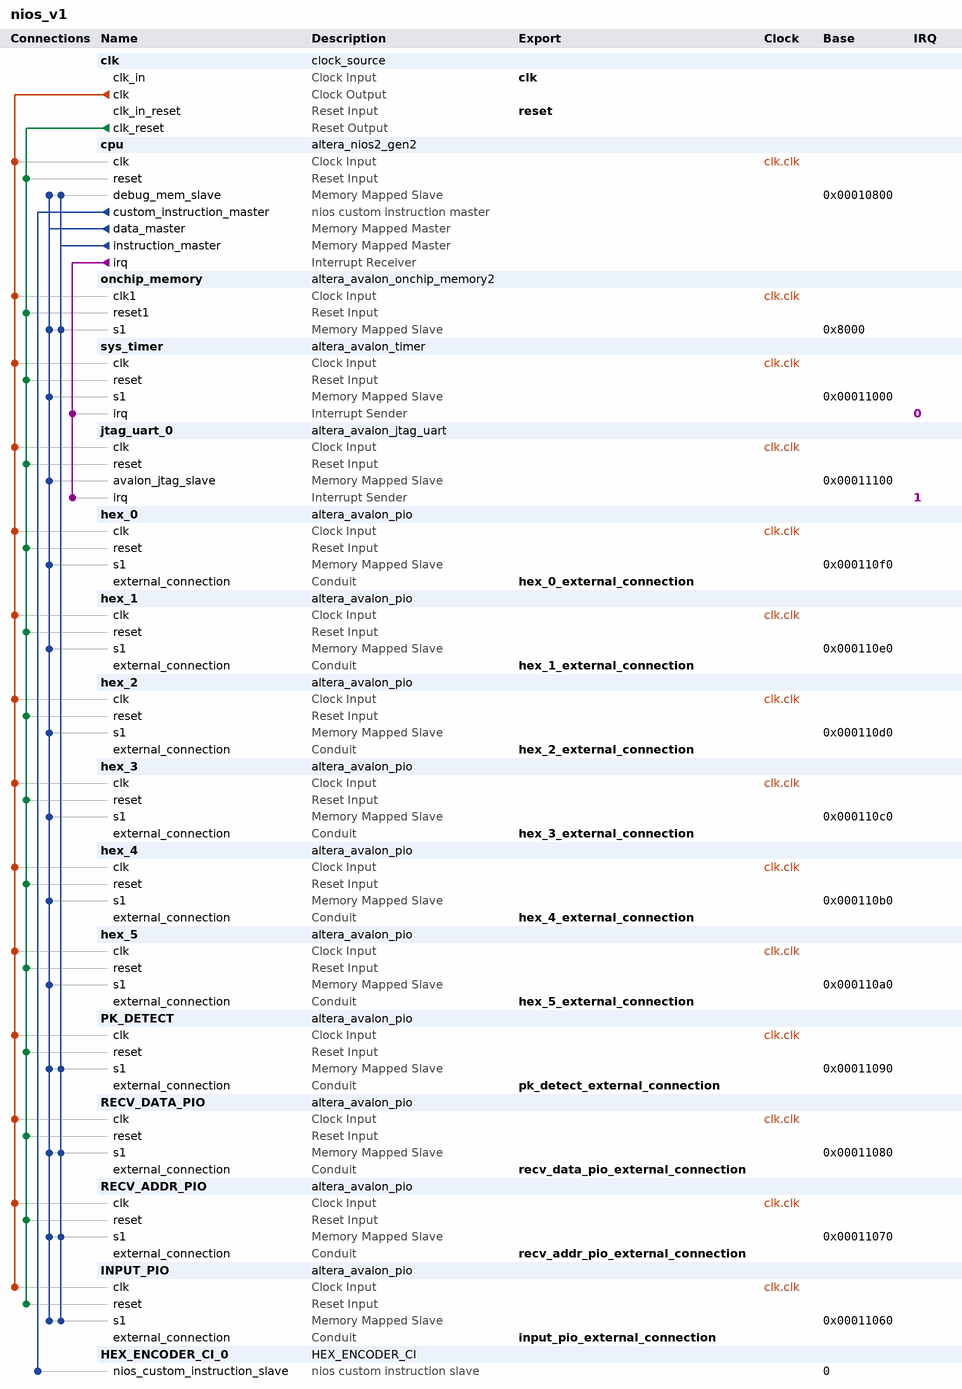
[diagram p0: system contents]
# Platform Designer (Qsys) system nios_v1, Cyclone V 5CSEMA5F31C6
# Parameters at their usual value, and those the tool derives, are not listed.
package require -exact qsys 18.1
create_system nios_v1
set_project_property DEVICE_FAMILY {Cyclone V}
set_project_property DEVICE 5CSEMA5F31C6

add_instance clk clock_source 18.1
set_instance_parameter_value clk clockFrequency 50000000

add_instance cpu altera_nios2_gen2 18.1
set_instance_parameter_value cpu cpuID 1
set_instance_parameter_value cpu dcache_size 2048
set_instance_parameter_value cpu exceptionSlave onchip_memory.s1
set_instance_parameter_value cpu icache_size 4096
set_instance_parameter_value cpu impl Fast
set_instance_parameter_value cpu resetSlave onchip_memory.s1

add_instance onchip_memory altera_avalon_onchip_memory2 18.1
set_instance_parameter_value onchip_memory dataWidth 32
set_instance_parameter_value onchip_memory dualPort false
set_instance_parameter_value onchip_memory initMemContent true
set_instance_parameter_value onchip_memory initializationFileName onchip_mem.hex
set_instance_parameter_value onchip_memory memorySize 20480

add_instance sys_timer altera_avalon_timer 18.1
set_instance_parameter_value sys_timer period 1
set_instance_parameter_value sys_timer periodUnits MSEC

add_instance jtag_uart_0 altera_avalon_jtag_uart 18.1
set_instance_parameter_value jtag_uart_0 simInteractiveOptions NO_INTERACTIVE_WINDOWS

add_instance hex_0 altera_avalon_pio 18.1
set_instance_parameter_value hex_0 direction Output
set_instance_parameter_value hex_0 width 7

add_instance hex_1 altera_avalon_pio 18.1
set_instance_parameter_value hex_1 direction Output
set_instance_parameter_value hex_1 width 7

add_instance hex_2 altera_avalon_pio 18.1
set_instance_parameter_value hex_2 direction Output
set_instance_parameter_value hex_2 width 7

add_instance hex_3 altera_avalon_pio 18.1
set_instance_parameter_value hex_3 direction Output
set_instance_parameter_value hex_3 width 7

add_instance hex_4 altera_avalon_pio 18.1
set_instance_parameter_value hex_4 direction Output
set_instance_parameter_value hex_4 width 7

add_instance hex_5 altera_avalon_pio 18.1
set_instance_parameter_value hex_5 direction Output
set_instance_parameter_value hex_5 width 7

add_instance PK_DETECT altera_avalon_pio 18.1
set_instance_parameter_value PK_DETECT direction Input
set_instance_parameter_value PK_DETECT width 1

add_instance RECV_DATA_PIO altera_avalon_pio 18.1
set_instance_parameter_value RECV_DATA_PIO direction Input
set_instance_parameter_value RECV_DATA_PIO width 32

add_instance RECV_ADDR_PIO altera_avalon_pio 18.1
set_instance_parameter_value RECV_ADDR_PIO direction Input
set_instance_parameter_value RECV_ADDR_PIO width 8

add_instance INPUT_PIO altera_avalon_pio 18.1
set_instance_parameter_value INPUT_PIO direction Input
set_instance_parameter_value INPUT_PIO width 32

add_instance HEX_ENCODER_CI_0 HEX_ENCODER_CI 1.0

# connections
add_connection clk.clk cpu.clk clock
add_connection clk.clk hex_0.clk clock
add_connection clk.clk hex_1.clk clock
add_connection clk.clk hex_2.clk clock
add_connection clk.clk hex_3.clk clock
add_connection clk.clk hex_4.clk clock
add_connection clk.clk hex_5.clk clock
add_connection clk.clk INPUT_PIO.clk clock
add_connection clk.clk jtag_uart_0.clk clock
add_connection clk.clk onchip_memory.clk1 clock
add_connection clk.clk PK_DETECT.clk clock
add_connection clk.clk RECV_ADDR_PIO.clk clock
add_connection clk.clk RECV_DATA_PIO.clk clock
add_connection clk.clk sys_timer.clk clock
add_connection clk.clk_reset cpu.reset reset
add_connection clk.clk_reset hex_0.reset reset
add_connection clk.clk_reset hex_1.reset reset
add_connection clk.clk_reset hex_2.reset reset
add_connection clk.clk_reset hex_3.reset reset
add_connection clk.clk_reset hex_4.reset reset
add_connection clk.clk_reset hex_5.reset reset
add_connection clk.clk_reset INPUT_PIO.reset reset
add_connection clk.clk_reset jtag_uart_0.reset reset
add_connection clk.clk_reset onchip_memory.reset1 reset
add_connection clk.clk_reset PK_DETECT.reset reset
add_connection clk.clk_reset RECV_ADDR_PIO.reset reset
add_connection clk.clk_reset RECV_DATA_PIO.reset reset
add_connection clk.clk_reset sys_timer.reset reset
add_connection cpu.data_master cpu.debug_mem_slave avalon
set_connection_parameter_value cpu.data_master/cpu.debug_mem_slave baseAddress 0x00010800
add_connection cpu.data_master hex_0.s1 avalon
set_connection_parameter_value cpu.data_master/hex_0.s1 baseAddress 0x000110f0
add_connection cpu.data_master hex_1.s1 avalon
set_connection_parameter_value cpu.data_master/hex_1.s1 baseAddress 0x000110e0
add_connection cpu.data_master hex_2.s1 avalon
set_connection_parameter_value cpu.data_master/hex_2.s1 baseAddress 0x000110d0
add_connection cpu.data_master hex_3.s1 avalon
set_connection_parameter_value cpu.data_master/hex_3.s1 baseAddress 0x000110c0
add_connection cpu.data_master hex_4.s1 avalon
set_connection_parameter_value cpu.data_master/hex_4.s1 baseAddress 0x000110b0
add_connection cpu.data_master hex_5.s1 avalon
set_connection_parameter_value cpu.data_master/hex_5.s1 baseAddress 0x000110a0
add_connection cpu.data_master INPUT_PIO.s1 avalon
set_connection_parameter_value cpu.data_master/INPUT_PIO.s1 baseAddress 0x00011060
add_connection cpu.data_master jtag_uart_0.avalon_jtag_slave avalon
set_connection_parameter_value cpu.data_master/jtag_uart_0.avalon_jtag_slave baseAddress 0x00011100
add_connection cpu.data_master onchip_memory.s1 avalon
set_connection_parameter_value cpu.data_master/onchip_memory.s1 baseAddress 0x8000
add_connection cpu.data_master PK_DETECT.s1 avalon
set_connection_parameter_value cpu.data_master/PK_DETECT.s1 baseAddress 0x00011090
add_connection cpu.data_master RECV_ADDR_PIO.s1 avalon
set_connection_parameter_value cpu.data_master/RECV_ADDR_PIO.s1 baseAddress 0x00011070
add_connection cpu.data_master RECV_DATA_PIO.s1 avalon
set_connection_parameter_value cpu.data_master/RECV_DATA_PIO.s1 baseAddress 0x00011080
add_connection cpu.data_master sys_timer.s1 avalon
set_connection_parameter_value cpu.data_master/sys_timer.s1 baseAddress 0x00011000
add_connection cpu.instruction_master cpu.debug_mem_slave avalon
set_connection_parameter_value cpu.instruction_master/cpu.debug_mem_slave baseAddress 0x00010800
add_connection cpu.instruction_master INPUT_PIO.s1 avalon
set_connection_parameter_value cpu.instruction_master/INPUT_PIO.s1 baseAddress 0x00011060
add_connection cpu.instruction_master onchip_memory.s1 avalon
set_connection_parameter_value cpu.instruction_master/onchip_memory.s1 baseAddress 0x8000
add_connection cpu.instruction_master PK_DETECT.s1 avalon
set_connection_parameter_value cpu.instruction_master/PK_DETECT.s1 baseAddress 0x00011090
add_connection cpu.instruction_master RECV_ADDR_PIO.s1 avalon
set_connection_parameter_value cpu.instruction_master/RECV_ADDR_PIO.s1 baseAddress 0x00011070
add_connection cpu.instruction_master RECV_DATA_PIO.s1 avalon
set_connection_parameter_value cpu.instruction_master/RECV_DATA_PIO.s1 baseAddress 0x00011080
add_connection cpu.irq jtag_uart_0.irq interrupt
set_connection_parameter_value cpu.irq/jtag_uart_0.irq irqNumber 1
add_connection cpu.irq sys_timer.irq interrupt
set_connection_parameter_value cpu.irq/sys_timer.irq irqNumber 0
add_connection cpu.custom_instruction_master HEX_ENCODER_CI_0.nios_custom_instruction_slave nios_custom_instruction
set_connection_parameter_value cpu.custom_instruction_master/HEX_ENCODER_CI_0.nios_custom_instruction_slave CIName hex_encoder_ci_0
set_connection_parameter_value cpu.custom_instruction_master/HEX_ENCODER_CI_0.nios_custom_instruction_slave baseAddress 0

# exported interfaces
add_interface clk clock sink
set_interface_property clk EXPORT_OF clk.clk_in
add_interface hex_0_external_connection conduit end
set_interface_property hex_0_external_connection EXPORT_OF hex_0.external_connection
add_interface hex_1_external_connection conduit end
set_interface_property hex_1_external_connection EXPORT_OF hex_1.external_connection
add_interface hex_2_external_connection conduit end
set_interface_property hex_2_external_connection EXPORT_OF hex_2.external_connection
add_interface hex_3_external_connection conduit end
set_interface_property hex_3_external_connection EXPORT_OF hex_3.external_connection
add_interface hex_4_external_connection conduit end
set_interface_property hex_4_external_connection EXPORT_OF hex_4.external_connection
add_interface hex_5_external_connection conduit end
set_interface_property hex_5_external_connection EXPORT_OF hex_5.external_connection
add_interface input_pio_external_connection conduit end
set_interface_property input_pio_external_connection EXPORT_OF INPUT_PIO.external_connection
add_interface pk_detect_external_connection conduit end
set_interface_property pk_detect_external_connection EXPORT_OF PK_DETECT.external_connection
add_interface recv_addr_pio_external_connection conduit end
set_interface_property recv_addr_pio_external_connection EXPORT_OF RECV_ADDR_PIO.external_connection
add_interface recv_data_pio_external_connection conduit end
set_interface_property recv_data_pio_external_connection EXPORT_OF RECV_DATA_PIO.external_connection
add_interface reset reset sink
set_interface_property reset EXPORT_OF clk.clk_in_reset

set_interconnect_requirement {$system} qsys_mm.clockCrossingAdapter HANDSHAKE
set_interconnect_requirement {$system} qsys_mm.enableEccProtection FALSE
set_interconnect_requirement {$system} qsys_mm.insertDefaultSlave FALSE
set_interconnect_requirement {$system} qsys_mm.maxAdditionalLatency 1

save_system nios_v1.qsys
